# EAGLE design 555 Monostable (EAGLE 6.5.0)
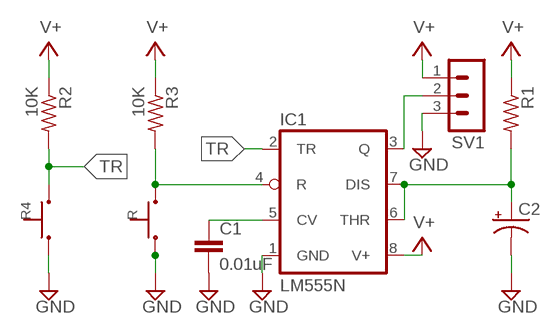
[diagram p0: schematic, sheet 1]

## Parts
C1  0.01uF  C-EU025-025X050  [C025-025X050]
C2  CPOL-USE1.8-4  [E1,8-4]
IC1  LM555N  [DIL08]
R  2PIN  [2PIN]
R1  R-US_0207/10  [0207/10]
R2  10K  R-US_0207/10  [0207/10]
R3  10K  R-US_0207/10  [0207/10]
R4  2PIN  [2PIN]
SV1  MA03-1  [MA03-1]

## Nets
GND: C1.2 C2.- IC1.1(GND) R4.1 R.1 SV1.3
N$1: IC1.4(R) R3.2 R.2
N$2: IC1.3(Q) SV1.2
N$3: C1.1 IC1.5(CV)
N$4: C2.+ IC1.6(THR) IC1.7(DIS) R1.2
TR: IC1.2(TR) R2.2 R4.2
V+: IC1.8(V+) R1.1 R2.1 R3.1 SV1.1

## Library data of the parts
C1 = rcl:C-EU: CAPACITOR, European symbol
C2 = resistor:CPOL-US: POLARIZED CAPACITOR, American symbol
IC1 = linear:*555: TIMER
R R4 = switch-tact:2PIN
R1-R3 = resistor:R-US_: RESISTOR, American symbol
SV1 = con-lstb:MA03-1: PIN HEADER; OC_FARNELL: unknown; OC_NEWARK: unknown

## Board
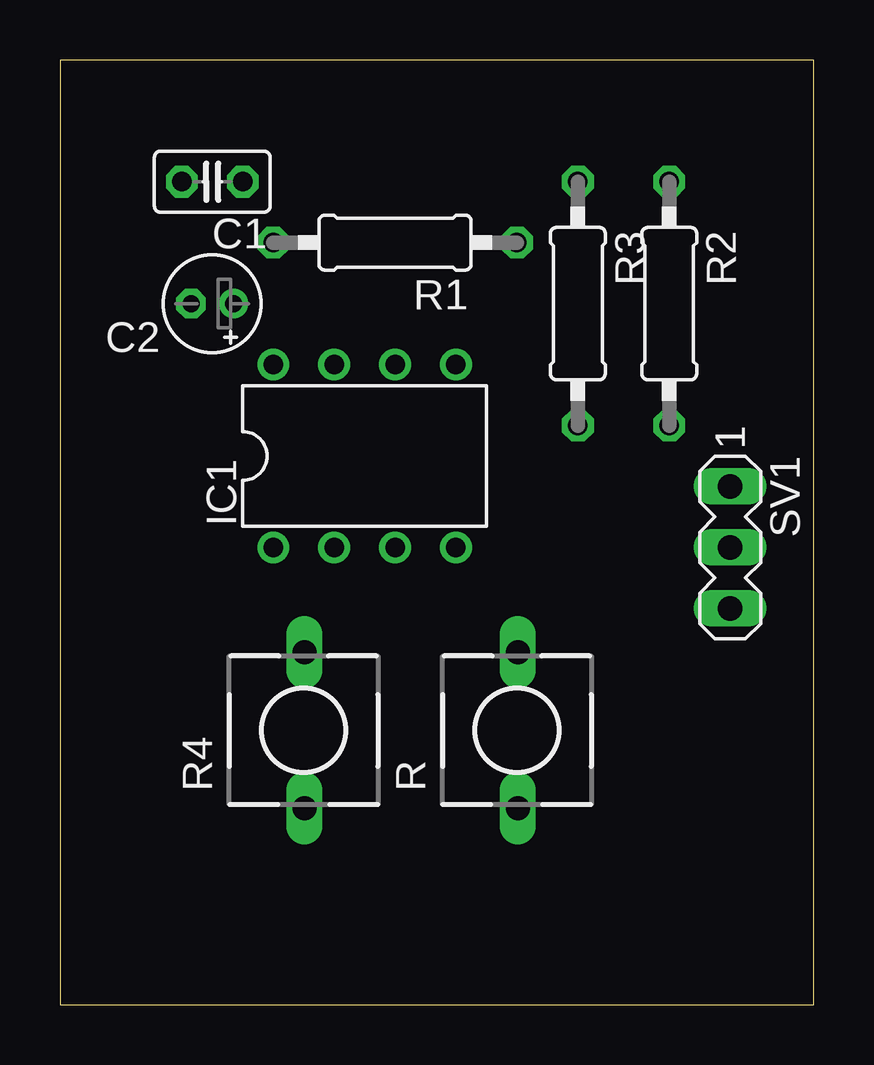
[diagram p1: board, top side]
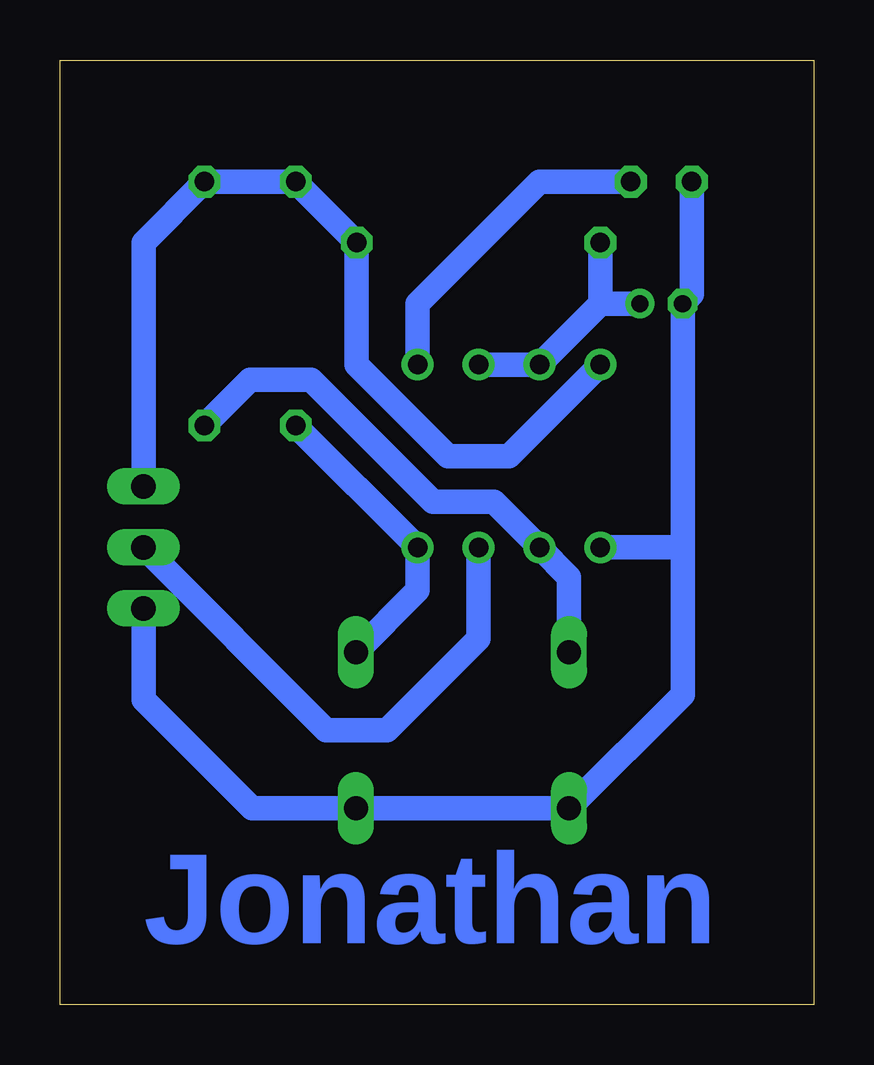
[diagram p2: board, bottom side, seen from below]

Size 31.42 x 39.36 mm. Coordinates in mm from the lower left corner, seen from the top.
Outline: 0,0 31.42,0 31.42,39.36 0,39.36 0,0
Copper layers (1*16): Top 0.035mm / dielectric 1.5mm / Bottom 0.035mm
Design rules "default": minimum track width 10mil, minimum drill 24mil, track to track 8mil, track to pad 8mil, pad to pad 8mil, via to via 8mil, smd to smd 8mil, copper to edge 40mil, drill to drill 8mil, minimum pad ring 10mil, minimum via ring 8mil, stop-mask expansion 4mil, vias tented up to drill 0mil, thermal gap 10mil

### Footprints (pad centres in the part's own frame; a part is rotated, then mirrored left to right if it is on the bottom)
C025-025X050 = drill 0.813 octagon: 1 -1.27,0; 2 1.27,0
E1,8-4 = drill 0.711 pad 1.168: + -0.889,0 | drill 0.711 pad 1.168 octagon: - 0.889,0
DIL08 = drill 0.813 pad 1.27: 1 -3.81,-3.81; 2 -1.27,-3.81; 3 1.27,-3.81; 4 3.81,-3.81; 5 3.81,3.81; 6 1.27,3.81; 7 -1.27,3.81; 8 -3.81,3.81
2PIN = drill 1 long: 1 -3.25,-0.036; 2 3.25,-0.036
0207/10 = drill 0.813 octagon: 1 -5.08,0; 2 5.08,0
MA03-1 = drill 1.016 long: 1 -2.54,0; 2 0,0; 3 2.54,0

### Placement (x,y rotation side)
C1  6.35,34.29 180 top
C2  6.35,29.21 180 top
IC1  12.7,22.86 0 top
R  19.05,11.43 90 top
R1  13.97,31.75 180 top
R2  25.4,29.21 270 top
R3  21.59,29.21 270 top
R4  10.16,11.43 90 top
SV1  27.94,19.05 270 top

### Tracks (layer width: path | path; a pad name or v marks a point on that pad's centre or on a via)
GND
  Bottom 1.016: SV1.3 27.94,12.7 23.42,8.18 R.1 R4.1 5.46,12.91 5.46,19.05 | C1.2 5.08,29.59 C2.- 5.46,19.05 | IC1.1 5.46,19.05
N$1
  Bottom 1.016: R.2 16.51,17.26 IC1.4 R3.2
N$2
  Bottom 1.016: IC1.3 13.97,15.24 17.78,11.43 20.32,11.43 SV1.2
N$3
  Bottom 1.016: C1.1 11.43,34.29 16.51,29.21 IC1.5
N$4
  Bottom 1.016: IC1.6 IC1.7 8.89,29.21 | C2.+ 8.89,29.21 | R1.2 8.89,29.21
TR
  Bottom 1.016: R4.2 10.2,17.82 IC1.2 13.34,20.95 15.88,20.95 20.95,26.04 23.5,26.04 R2.2
V+
  Bottom 1.016: SV1.1 27.94,31.75 R2.1 R3.1 R1.1 19.05,26.67 15.24,22.86 12.7,22.86 IC1.8

### Text on the board
Bottom: Jonathan